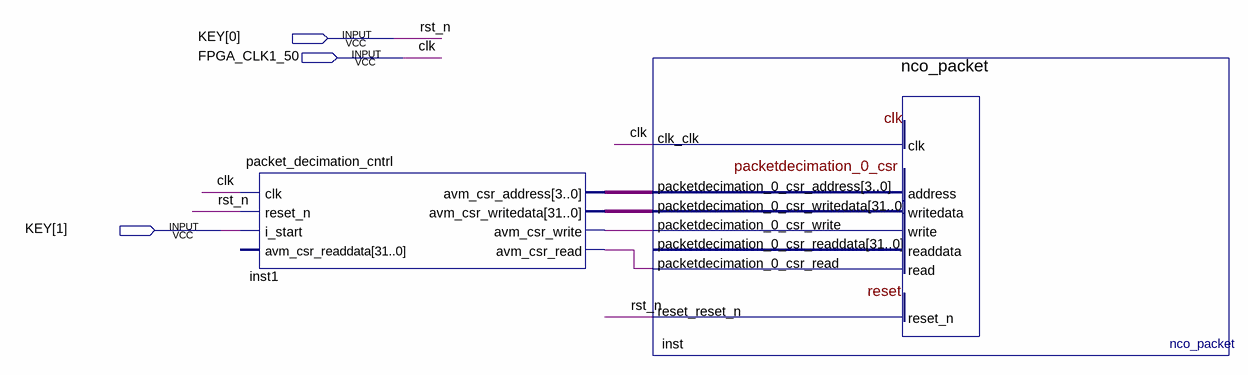
[diagram p0: schematic sheet]
// Quartus schematic eth_test.bdf as structural Verilog: 2 symbols, 3 pins
module eth_test (
  input  [1:0] KEY,
  input  FPGA_CLK1_50
);

  wire inst1_avm_csr_read, inst1_avm_csr_write;
  wire [3:0] inst1_avm_csr_address;
  wire [31:0] inst1_avm_csr_writedata;

  packet_decimation_cntrl inst1 (
    .clk(FPGA_CLK1_50), .reset_n(KEY[0]), .i_start(KEY[1]), .avm_csr_address(inst1_avm_csr_address),
    .avm_csr_writedata(inst1_avm_csr_writedata), .avm_csr_write(inst1_avm_csr_write),
    .avm_csr_read(inst1_avm_csr_read));  // open: avm_csr_readdata
  nco_packet inst (
    .clk_clk(FPGA_CLK1_50), .packetdecimation_0_csr_address(inst1_avm_csr_address),
    .packetdecimation_0_csr_writedata(inst1_avm_csr_writedata),
    .packetdecimation_0_csr_write(inst1_avm_csr_write), .packetdecimation_0_csr_read(inst1_avm_csr_read),
    .reset_reset_n(KEY[0]));  // open: packetdecimation_0_csr_readdata

  // Other names for the same wires on the sheet: clk = FPGA_CLK1_50; rst_n = KEY[0]
endmodule
